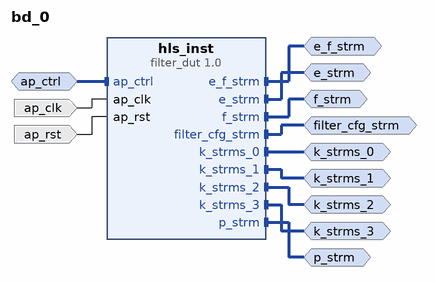
[diagram p0: block diagram of the top level]
# Vivado block design bd_0, xcvu9p-flga2104-2-i, Vivado 2024.1
create_bd_design bd_0

create_bd_intf_port -mode Slave -vlnv xilinx.com:interface:acc_handshake_rtl:1.0 ap_ctrl
create_bd_intf_port -mode Master -vlnv xilinx.com:interface:acc_fifo_write_rtl:1.0 e_f_strm
create_bd_intf_port -mode Master -vlnv xilinx.com:interface:acc_fifo_read_rtl:1.0 e_strm
create_bd_intf_port -mode Master -vlnv xilinx.com:interface:acc_fifo_write_rtl:1.0 f_strm
create_bd_intf_port -mode Master -vlnv xilinx.com:interface:acc_fifo_read_rtl:1.0 filter_cfg_strm
create_bd_intf_port -mode Master -vlnv xilinx.com:interface:acc_fifo_read_rtl:1.0 k_strms_0
create_bd_intf_port -mode Master -vlnv xilinx.com:interface:acc_fifo_read_rtl:1.0 k_strms_1
create_bd_intf_port -mode Master -vlnv xilinx.com:interface:acc_fifo_read_rtl:1.0 k_strms_2
create_bd_intf_port -mode Master -vlnv xilinx.com:interface:acc_fifo_read_rtl:1.0 k_strms_3
create_bd_intf_port -mode Master -vlnv xilinx.com:interface:acc_fifo_read_rtl:1.0 p_strm
create_bd_port -dir I -type clk ap_clk
set_property -dict {CONFIG.FREQ_HZ 100000000.0} [get_bd_ports ap_clk]
create_bd_port -dir I -type rst ap_rst
set_property -dict {CONFIG.POLARITY ACTIVE_HIGH} [get_bd_ports ap_rst]

create_bd_cell -type ip -vlnv xilinx.com:hls:filter_dut:1.0 hls_inst

# ---- connections ----

connect_bd_intf_net -intf_net ap_ctrl_0_1 [get_bd_intf_ports ap_ctrl] [get_bd_intf_pins hls_inst/ap_ctrl]
connect_bd_intf_net [get_bd_intf_ports e_f_strm] [get_bd_intf_pins hls_inst/e_f_strm]
connect_bd_intf_net [get_bd_intf_ports e_strm] [get_bd_intf_pins hls_inst/e_strm]
connect_bd_intf_net [get_bd_intf_ports f_strm] [get_bd_intf_pins hls_inst/f_strm]
connect_bd_intf_net [get_bd_intf_ports filter_cfg_strm] [get_bd_intf_pins hls_inst/filter_cfg_strm]
connect_bd_intf_net [get_bd_intf_ports k_strms_0] [get_bd_intf_pins hls_inst/k_strms_0]
connect_bd_intf_net [get_bd_intf_ports k_strms_1] [get_bd_intf_pins hls_inst/k_strms_1]
connect_bd_intf_net [get_bd_intf_ports k_strms_2] [get_bd_intf_pins hls_inst/k_strms_2]
connect_bd_intf_net [get_bd_intf_ports k_strms_3] [get_bd_intf_pins hls_inst/k_strms_3]
connect_bd_intf_net [get_bd_intf_ports p_strm] [get_bd_intf_pins hls_inst/p_strm]
connect_bd_net -net ap_clk_0_1 [get_bd_ports ap_clk] [get_bd_pins hls_inst/ap_clk]
connect_bd_net -net ap_rst_0_1 [get_bd_ports ap_rst] [get_bd_pins hls_inst/ap_rst]

validate_bd_design
save_bd_design
